# Altium schematic sheet main.SchDoc
size A4
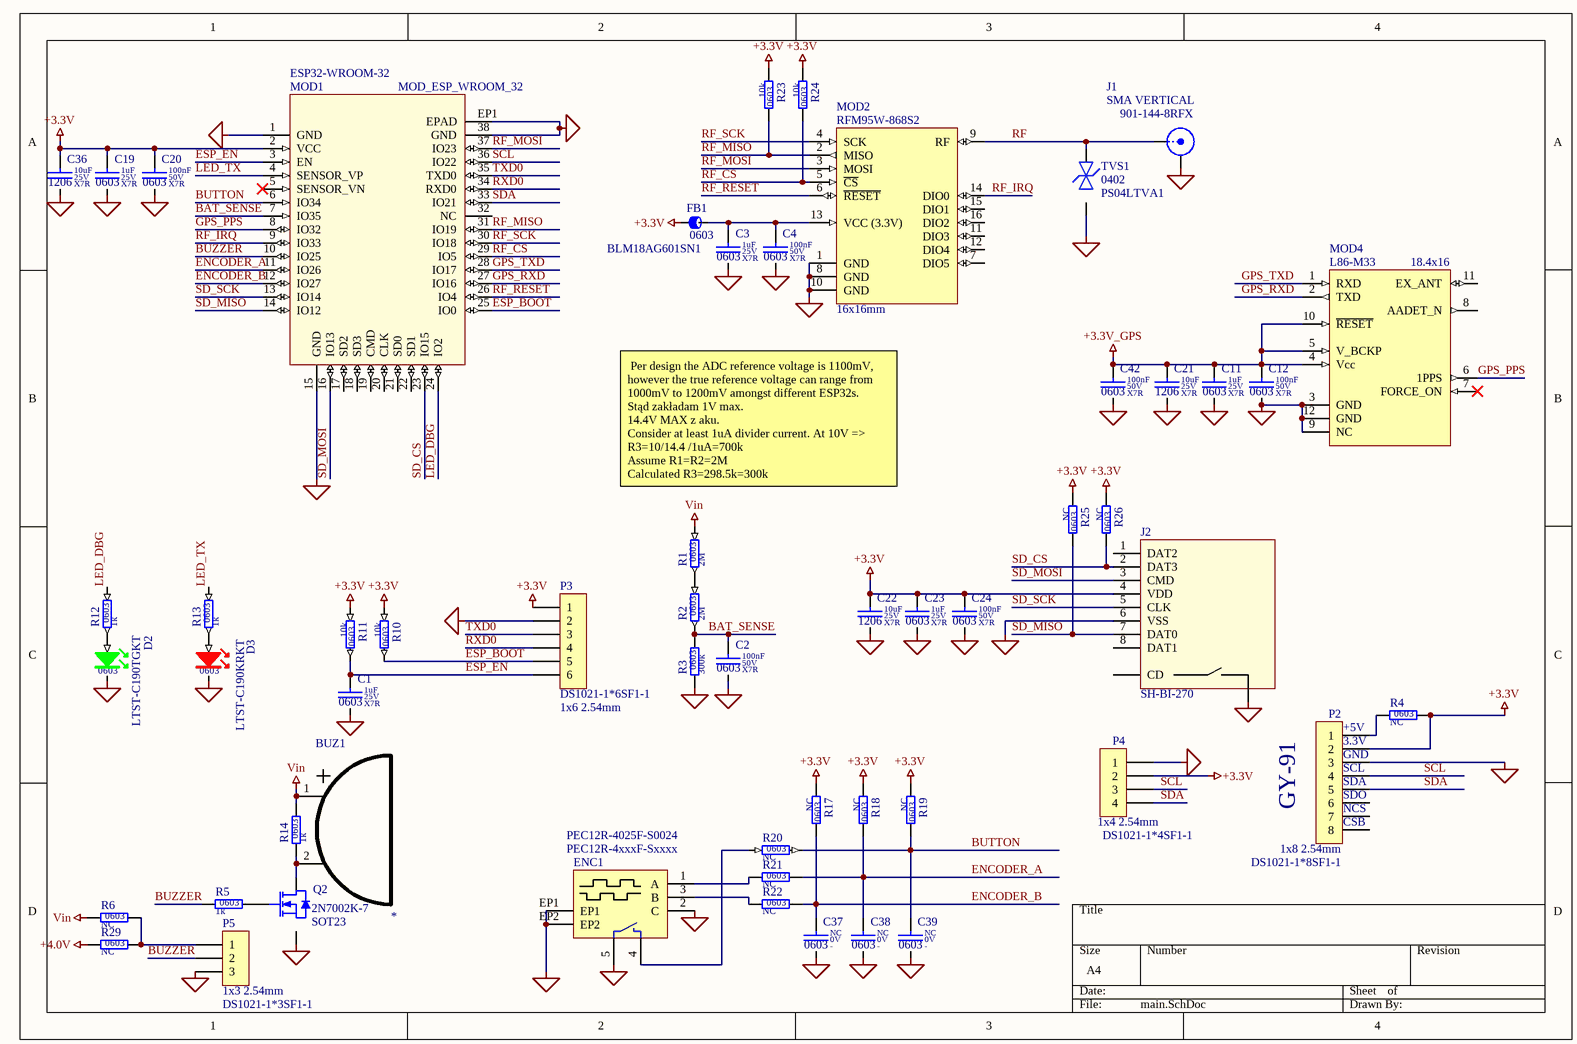
[diagram p0: main.SchDoc]

## Parts
BUZ1  BUZ_CHINA  [BUZ_CHINA]  (value not drawn)
C1  value 1uF  Dielectric: X7R  Voltage: 25V  SCH_Footprint: 0603  [C_0603_1608]  (hidden comment: Ceramic X7R)
C2  value 100nF  Dielectric: X7R  Voltage: 50V  SCH_Footprint: 0603  [C_0603_1608]  (hidden comment: Ceramic X7R)
C3  value 1uF  Dielectric: X7R  Voltage: 25V  SCH_Footprint: 0603  [C_0603_1608]  (hidden comment: Ceramic X7R)
C4  value 100nF  Dielectric: X7R  Voltage: 50V  SCH_Footprint: 0603  [C_0603_1608]  (hidden comment: Ceramic X7R)
C11  value 1uF  Dielectric: X7R  Voltage: 25V  SCH_Footprint: 0603  [C_0603_1608]  (hidden comment: Ceramic X7R)
C12  value 100nF  Dielectric: X7R  Voltage: 50V  SCH_Footprint: 0603  [C_0603_1608]  (hidden comment: Ceramic X7R)
C19  value 1uF  Dielectric: X7R  Voltage: 25V  SCH_Footprint: 0603  [C_0603_1608]  (hidden comment: Ceramic X7R)
C20  value 100nF  Dielectric: X7R  Voltage: 50V  SCH_Footprint: 0603  [C_0603_1608]  (hidden comment: Ceramic X7R)
C21  value 10uF  Dielectric: X7R  Voltage: 25V  SCH_Footprint: 1206  [C_1206_3216]  (hidden comment: Ceramic X7R)
C22  value 10uF  Dielectric: X7R  Voltage: 25V  SCH_Footprint: 1206  [C_1206_3216]  (hidden comment: Ceramic X7R)
C23  value 1uF  Dielectric: X7R  Voltage: 25V  SCH_Footprint: 0603  [C_0603_1608]  (hidden comment: Ceramic X7R)
C24  value 100nF  Dielectric: X7R  Voltage: 50V  SCH_Footprint: 0603  [C_0603_1608]  (hidden comment: Ceramic X7R)
C36  value 10uF  Dielectric: X7R  Voltage: 25V  SCH_Footprint: 1206  [C_1206_3216]  (hidden comment: Ceramic X7R)
C37  value NC  Voltage: 0V  SCH_Footprint: 0603  [C_NC_0603_1608]  (hidden comment: -)
C38  value NC  Voltage: 0V  SCH_Footprint: 0603  [C_NC_0603_1608]  (hidden comment: -)
C39  value NC  Voltage: 0V  SCH_Footprint: 0603  [C_NC_0603_1608]  (hidden comment: -)
C42  value 100nF  Dielectric: X7R  Voltage: 50V  SCH_Footprint: 0603  [C_0603_1608]  (hidden comment: Ceramic X7R)
D2  value LTST-C190TGKT  SCH_Footprint: 0603  [OL_0603_1608]  (hidden comment: Green Led)
D3  value LTST-C190KRKT  SCH_Footprint: 0603  [OL_0603_1608]  (hidden comment: Red Led)
ENC1  value PEC12R-4025F-S0024  [PEC12R-4xxxF-Sxxxx]  (hidden comment: ENCODER)
FB1  value BLM18AG601SN1  SCH_Footprint: 0603  [FB_0603_1608]  (hidden comment: Ferrite bead)
J1  value 901-144-8RFX  [J_SMA_VERTICAL]  (hidden comment: SMA VERTICAL)
J2  SH-BI-270  [SDCARD]
MOD1  value ESP32-WROOM-32  [MOD_ESP_WROOM_32]  (hidden comment: 2.4 GHz Wi-Fi-and-Bluetooth combo chip)
MOD2  value RFM95W-868S2  SCH_Footprint: 16x16mm  [MOD_RFM95]  (hidden comment: RFM95(W) - Low Power Long Range Transceiver Module + LoRa)
MOD4  value L86-M33  SCH_Footprint: 18.4x16  [MOD_L86-M33]  (hidden comment: GPS with Patch antenna)
P2  value DS1021-1*8SF1-1  SCH_Footprint: 1x8 2.54mm  [P_HEADER_1x8_2.54]  (hidden comment: Goldpin)
P3  value DS1021-1*6SF1-1  SCH_Footprint: 1x6 2.54mm  [P_HEADER_1x6_2.54]  (hidden comment: Goldpin)
P4  value DS1021-1*4SF1-1  SCH_Footprint: 1x4 2.54mm  [P_HEADER_1x4_2.54]  (hidden comment: Goldpin)
P5  value DS1021-1*3SF1-1  SCH_Footprint: 1x3 2.54mm  [P_HEADER_1x3_2.54]  (hidden comment: Goldpin)
Q2  SCH_Footprint: SOT23  [SOT23_TO236_SC59]  (hidden comment: 2N7002K-7)
R1  value 2M  SCH_Footprint: 0603  [R_0603_1608]  (hidden comment: Resistor)
R2  value 2M  SCH_Footprint: 0603  [R_0603_1608]  (hidden comment: Resistor)
R3  value 300k  SCH_Footprint: 0603  [R_0603_1608]  (hidden comment: Resistor)
R4  value NC  SCH_Footprint: 0603  [R_NC_0603_1608]  (hidden comment: Resistor)
R5  value 1k  SCH_Footprint: 0603  [R_0603_1608]  (hidden comment: Resistor)
R6  value NC  SCH_Footprint: 0603  [R_NC_0603_1608]  (hidden comment: Resistor)
R10  value 10k  SCH_Footprint: 0603  [R_0603_1608]  (hidden comment: Resistor)
R11  value 10k  SCH_Footprint: 0603  [R_0603_1608]  (hidden comment: Resistor)
R12  value 1k  SCH_Footprint: 0603  [R_0603_1608]  (hidden comment: Resistor)
R13  value 1k  SCH_Footprint: 0603  [R_0603_1608]  (hidden comment: Resistor)
R14  value 1k  SCH_Footprint: 0603  [R_0603_1608]  (hidden comment: Resistor)
R17  value NC  SCH_Footprint: 0603  [R_NC_0603_1608]  (hidden comment: Resistor)
R18  value NC  SCH_Footprint: 0603  [R_NC_0603_1608]  (hidden comment: Resistor)
R19  value NC  SCH_Footprint: 0603  [R_NC_0603_1608]  (hidden comment: Resistor)
R20  value NC  SCH_Footprint: 0603  [R_NC_0603_1608]  (hidden comment: Resistor)
R21  value NC  SCH_Footprint: 0603  [R_NC_0603_1608]  (hidden comment: Resistor)
R22  value NC  SCH_Footprint: 0603  [R_NC_0603_1608]  (hidden comment: Resistor)
R23  value 10k  SCH_Footprint: 0603  [R_0603_1608]  (hidden comment: Resistor)
R24  value 10k  SCH_Footprint: 0603  [R_0603_1608]  (hidden comment: Resistor)
R25  value NC  SCH_Footprint: 0603  [R_NC_0603_1608]  (hidden comment: Resistor)
R26  value NC  SCH_Footprint: 0603  [R_NC_0603_1608]  (hidden comment: Resistor)
R29  value NC  SCH_Footprint: 0603  [R_NC_0603_1608]  (hidden comment: Resistor)
TVS1  value PS04LTVA1  SCH_Footprint: 0402  [D_BI_0402_1005]  (hidden comment: ESD Suppressors / TVS Diodes)

## Nets
+3.3V: C19.1 C20.1 C22.1 C23.1 C24.1 C36.1 FB1.1 J2.4(VDD) MOD1.2(VCC) P2.2 P3.1 P4.2 R4.2 R10.1 R11.1 R17.1 R18.1 R19.1 R23.1 R24.1 R25.1 R26.1
+3.3V_GPS: C11.1 C12.1 C21.1 C42.1 MOD4.4(Vcc) MOD4.5(V_BCKP) MOD4.10(~{RESET})
+4.0V: R29.1
GND: C1.2 C2.2 C3.2 C4.2 C11.2 C12.2 C19.2 C20.2 C21.2 C22.2 C23.2 C24.2 C36.2 C37.2 C38.2 C39.2 C42.2 D2.1(K) D3.1(K) ENC1.2(C) ENC1.5(SW) ENC1.EP1 ENC1.EP2 J1.2(GND) J2.6(VSS) J2.S0(CD_VSS) MOD1.1(GND) MOD1.15(GND) MOD1.38(GND) MOD1.EP1(EPAD) MOD2.1(GND) MOD2.8(GND) MOD2.10(GND) MOD4.3(GND) MOD4.9(NC) MOD4.12(GND) P2.3 P3.2 P4.1 P5.3 Q2.2(S) R3.1 TVS1.2
Vin: BUZ1.1 R1.2 R6.1 R14.2
BAT_SENSE: C2.1 MOD1.7(IO35) R2.1 R3.2
BUTTON: C39.1 MOD1.6(IO34) R19.2 R20.2
BUZZER: MOD1.10(IO25) P5.2 R5.1
ENCODER_A: C38.1 MOD1.11(IO26) R18.2 R21.2
ENCODER_B: C37.1 MOD1.12(IO27) R17.2 R22.2
ESP_BOOT: MOD1.25(IO0) P3.5 R10.2
ESP_EN: C1.1 MOD1.3(EN) P3.6 R11.2
GPS_PPS: MOD1.8(IO32) MOD4.6(1PPS)
GPS_RXD: MOD1.27(IO16) MOD4.2(TXD)
GPS_TXD: MOD1.28(IO17) MOD4.1(RXD)
LED_DBG: MOD1.24(IO2) R12.2
LED_TX: MOD1.4(SENSOR_VP) R13.2
RF: J1.1(X) MOD2.9(RF) TVS1.1
RF_CS: MOD1.29(IO5) MOD2.5(~{CS}) R24.2
RF_IRQ: MOD1.9(IO33) MOD2.14(DIO0)
RF_MISO: MOD1.31(IO19) MOD2.2(MISO) R23.2
RF_MOSI: MOD1.37(IO23) MOD2.3(MOSI)
RF_RESET: MOD1.26(IO4) MOD2.6(~{RESET})
RF_SCK: MOD1.30(IO18) MOD2.4(SCK)
RXD0: MOD1.34(RXD0) P3.4
SCL: MOD1.36(IO22) P2.4 P4.3
SD_CS: J2.2(DAT3) MOD1.23(IO15) R26.2
SD_MISO: J2.7(DAT0) MOD1.14(IO12) R25.2
SD_MOSI: J2.3(CMD) MOD1.16(IO13)
SD_SCK: J2.5(CLK) MOD1.13(IO14)
SDA: MOD1.33(IO21) P2.5 P4.4
TXD0: MOD1.35(TXD0) P3.3
NetBUZ1_2: BUZ1.2 Q2.3(D) R14.1
NetC3_1: C3.1 C4.1 FB1.2 MOD2.13(VCC_(3.3V))
NetD2_2: D2.2(A) R12.1
NetD3_2: D3.2(A) R13.1
NetENC1_1: ENC1.1(A) R21.1
NetENC1_3: ENC1.3(B) R22.1
NetENC1_4: ENC1.4(SW) R20.1
NetP2_1: P2.1 R4.1
NetP5_1: P5.1 R6.2 R29.2
NetQ2_1: Q2.1(G) R5.2
NetR1_1: R1.1 R2.2

Not connected (* = marked no-connect by the designer): J2 1(DAT2) 8(DAT1) CD; MOD1 5(SENSOR_VN)* 17(SD2) 18(SD3) 19(CMD) 20(CLK) 21(SD0) 22(SD1) 32(NC); MOD2 7(DIO5) 11(DIO3) 12(DIO4) 15(DIO1) 16(DIO2); MOD4 7(FORCE_ON)* 8(AADET_N) 11(EX_ANT); P2 6 7 8

## Notes on the sheet
- Per design the ADC reference voltage is 1100mV, however the true reference voltage can range from 1000mV to 1200mV amongst different ESP32s.
  Stąd zakładam 1V max.
  14.4V MAX z aku.
  Consider at least 1uA divider current. At 10V =>
  R3=10/14.4 /1uA=700k
  Assume R1=R2=2M
  Calculated R3=298.5k=300k
- (near P2) +5V
- (near P2) 3.3V
- (near P2) GND
- (near P2) SCL
- (near P2) SDA
- (near P2) SDO
- (near P2) GY-91
- (near P2) NCS
- (near P2) CSB

## Library data of the parts
C1 C3 C11 C19 C23 = C_1uF_25V_X7R_0603_10: Capacitor; Manufacturer: Samsung; Manufacturer Part Number: CL10B105KA8NNNC; Tolerance (%): 10; Part Number: C_1uF_25V_X7R_0603_10; HelpURL: http://www.tme.eu/pl/Document/4a42202b32dab16128fe107dd69598cc/samsung-chip-cap.pdf; Supplier 1: TME; Supplier Part Number 1: CL10B105KA8NNNC; Supplier 2: RS Components; Supplier 3: Farnell; Supplier 4: Mouser; Supplier 5: Digi-Key; Supplier 6: LCSC
C2 C4 C12 C20 C24 C42 = C_100nF_50V_X7R_0603_5: Capacitor; Manufacturer: Samsung; Manufacturer Part Number: CL10B104JB8NNNC; Tolerance (%): 5; Part Number: C_100nF_50V_X7R_0603_5; HelpURL: http://www.tme.eu/pl/Document/4a42202b32dab16128fe107dd69598cc/samsung-chip-cap.pdf; Supplier 1: TME; Supplier Part Number 1: CL10B104JB8NNNC; Supplier 2: RS Components; Supplier Part Number 2: 7665455; Supplier 3: Farnell; Supplier 4: Mouser; Supplier 5: Digi-Key; Supplier Part Number 5: 1276-1033-1-ND; Supplier 6: LCSC; Supplier Part Number 6: C24452
C21 C22 C36 = C_10uF_25V_X7R_1206_10: Capacitor; Manufacturer: Samsung Electro-Mechanics; Manufacturer Part Number: CL31B106KAHNNNE; Tolerance (%): 10; Part Number: C_10uF_25V_X7R_1206_10; HelpURL: http://www.tme.eu/pl/Document/4a42202b32dab16128fe107dd69598cc/samsung-chip-cap.pdf; Supplier 1: TME; Supplier Part Number 1: CL31B106KAHNNNE; Supplier 2: RS Components; Supplier 3: Farnell; Supplier 4: Mouser; Supplier 5: Digi-Key; Supplier 6: LCSC
C37-C39 = C_GENERIC_0603: Capacitor; Tolerance (%): 0; Dielectric: -; Part Number: C_GENERIC_0603; HelpURL: http://-; Manufacturer: -; Manufacturer Part Number: -; Supplier 1: TME; Supplier 2: RS Components; Supplier 3: Farnell; Supplier 4: Mouser; Supplier 5: Digi-Key; Supplier 6: LCSC
D2 = OL_G_0603: LED GREEN; Manufacturer: Lite-On; Part Number: OL_G_0603; HelpURL: https://datasheet.octopart.com/LTST-C190TGKT-Lite-On-datasheet-158437.pdf; Manufacturer Part Number: LTST-C190TGKT; Supplier 1: TME; Supplier Part Number 1: LTST-C190TGKT; Supplier 2: RS Components; Supplier Part Number 2: 6920997P; Supplier 3: Farnell; Supplier 4: Mouser; Supplier Part Number 4: 859-LTST-C190TGKT; Supplier 5: Digi-Key; Supplier Part Number 5: 160-2019-1-ND; Supplier 6: LCSC
D3 = OL_R_0603: LED_RED; Manufacturer: Lite-On; Part Number: OL_R_0603; HelpURL: https://datasheet.octopart.com/LTST-C190KRKT-Lite-On-datasheet-158191.pdf; Manufacturer Part Number: LTST-C190KRKT; Supplier 1: TME; Supplier Part Number 1: LTST-C190KRKT; Supplier 2: RS Components; Supplier Part Number 2: 1769795; Supplier 3: Farnell; Supplier 4: Mouser; Supplier Part Number 4: 859-LTST-C190KRKT; Supplier 5: Digi-Key; Supplier Part Number 5: 160-1436-1-ND; Supplier 6: LCSC
ENC1 = ENC_PEC12R-4025F-S0024: Manufacturer: Bourns; Part Number: ENC_PEC12R-4025F-S0024; SCH_Footprint: PEC12R-4xxxF-Sxxxx; HelpURL: https://datasheet.octopart.com/PEC12R-4025F-S0024-Bourns-datasheet-44395047.pdf; Manufacturer Part Number: PEC12R-4025F-S0024; Supplier 1: TME; Supplier Part Number 1: PEC12R-4025F-S0024; Supplier 2: RS Components; Supplier Part Number 2: 789-9649; Supplier 3: Farnell; Supplier Part Number 3: 2814036; Supplier 4: Mouser; Supplier Part Number 4: 652-PEC12R-4025F-S24; Supplier 5: Digi-Key; Supplier Part Number 5: PEC12R-4025F-S0024-ND; Supplier 6: LCSC
FB1 = FB_BLM18AG601SN1: Manufacturer: Murata; Manufacturer Part Number: BLM18AG601SN1D; Current: 500mA; Resistance: 600R; Part Number: FB_BLM18AG601SN1; HelpURL: http://datasheet.octopart.com/BLM18AG601SN1D-Murata-datasheet-11743096.pdf; Supplier 1: TME; Supplier Part Number 1: BLM18AG601SN1D; Supplier 2: RS Components; Supplier Part Number 2: 7241299P; Supplier 3: Farnell; Supplier Part Number 3: 1515679; Supplier 4: Mouser; Supplier Part Number 4: 81-BLM11A601S; Supplier 5: Digi-Key; Supplier Part Number 5: 490-1014-1-ND; Supplier 6: LCSC
J1 = J_SMA_VERTICAL: SMA connector; Manufacturer: Amphenol RF; Part Number: J_SMA_VERTICAL; SCH_Footprint: SMA VERTICAL; HelpURL: http://www.mouser.com/ds/2/18/C901-144-8RFX-710432.pdf; Manufacturer Part Number: 901-144-8RFX; Supplier 1: TME; Supplier 2: RS Components; Supplier 3: Farnell; Supplier Part Number 3: 1339820; Supplier 4: Mouser; Supplier Part Number 4: 523-901-144-8RFX; Supplier 5: Digi-Key; Supplier Part Number 5: ARFX1231-ND; Supplier 6: LCSC
J2 = sd_china: SH-BI-270 Chinese microSD socket; CustomComponentID: xyn8wfk4aykgkvbxxkv0
MOD1 = MOD_ESP32-WROOM-32: Manufacturer: ESPRESSIF; SCH_Footprint: MOD_ESP_WROOM_32; Part Number: MOD_ESP32-WROOM-32; HelpURL: https://www.espressif.com/sites/default/files/documentation/esp32_datasheet_en.pdf; Manufacturer Part Number: ESP32-WROOM-32; Supplier 1: TME; Supplier Part Number 1: ESP32-WROOM-32; Supplier 2: RS Components; Supplier Part Number 2: 169-7594; Supplier 3: Farnell; Supplier 4: Mouser; Supplier Part Number 4: 356-ESP-WROOM-32; Supplier 5: Digi-Key; Supplier Part Number 5: 1904-1010-1-ND; Supplier 6: LCSC
MOD2 = MOD_RFM95W-868S2: RFM95/96/97/98(W) - Low Power Long Range Transceiver Module; Manufacturer: HopeRF; Part Number: MOD_RFM95W-868S2; HelpURL: https://cdn.sparkfun.com/assets/learn_tutorials/8/0/4/RFM95_96_97_98W.pdf; Manufacturer Part Number: RFM95W-868S2; Supplier 1: TME; Supplier Part Number 1: RFM95W-868S2; Supplier 2: RS Components; Supplier Part Number 2: 1251259; Supplier 3: Farnell; Supplier Part Number 3: 2759294; Supplier 4: Mouser; Supplier Part Number 4: 223-RFM95W-868S2; Supplier 5: Digi-Key; Supplier Part Number 5: RFM95W-868S2-ND; Supplier 6: LCSC
MOD4 = MOD_L86-M33: GPS; Manufacturer: Quectel; Part Number: MOD_L86-M33; HelpURL: https://www.codico.com/shop/media/datasheets/Quectel_L86_Hardware_Design_V1.1.pdf; Manufacturer Part Number: L86-M33; Supplier 1: TME; Supplier 2: RS Components; Supplier Part Number 2: 9084114; Supplier 3: Farnell; Supplier 4: Mouser; Supplier 5: Digi-Key; Supplier 6: LCSC
P2 = P_HEADER_1x8_2.54: Pin Header; Manufacturer: Connfly; Part Number: P_HEADER_1x8_2.54; HelpURL: http://www.tme.eu/en/Document/cc301e58a5da78cb543a94b5a5b7f06a/DS1021.pdf; Manufacturer Part Number: DS1021-1*8SF1-1; Supplier 1: TME; Supplier Part Number 1: ZL201-08G; Supplier 2: RS Components; Supplier 3: Farnell; Supplier 4: Mouser; Supplier 5: Digi-Key; Supplier 6: LCSC
P3 = P_HEADER_1x6_2.54: Pin Header; Manufacturer: Connfly; Part Number: P_HEADER_1x6_2.54; HelpURL: http://www.tme.eu/en/Document/cc301e58a5da78cb543a94b5a5b7f06a/DS1021.pdf; Manufacturer Part Number: DS1021-1*6SF1-1; Supplier 1: TME; Supplier Part Number 1: ZL201-06G; Supplier 2: RS Components; Supplier 3: Farnell; Supplier 4: Mouser; Supplier 5: Digi-Key; Supplier 6: LCSC
P4 = P_HEADER_1x4_2.54: Pin Header; Manufacturer: Connfly; Part Number: P_HEADER_1x4_2.54; HelpURL: http://datasheet.octopart.com/DS1021-1%2A4SF1-1-Connfly-datasheet-65537859.pdf; Manufacturer Part Number: DS1021-1*4SF1-1; Supplier 1: TME; Supplier Part Number 1: ZL201-04G; Supplier 2: RS Components; Supplier 3: Farnell; Supplier 4: Mouser; Supplier 5: Digi-Key; Supplier 6: LCSC
P5 = P_HEADER_1x3_2.54: Pin Header; Manufacturer: Connfly; Part Number: P_HEADER_1x3_2.54; HelpURL: http://www.tme.eu/en/Document/cc301e58a5da78cb543a94b5a5b7f06a/DS1021.pdf; Manufacturer Part Number: DS1021-1*3SF1-1; Supplier 1: TME; Supplier Part Number 1: ZL201-03G; Supplier 2: RS Components; Supplier 3: Farnell; Supplier 4: Mouser; Supplier 5: Digi-Key; Supplier 6: LCSC
Q2 = QN_2N7002K-7_60V_350mA: Manufacturer: DIODES inc; Type: N-MOS; Voltage: 60V; Current: 0A8; Part Number: QN_2N7002K-7_60V_350mA; Value: 2N7002K-7; HelpURL: http://datasheet.octopart.com/2N7002K-7-Diodes-Inc.-datasheet-12515815.pdf; Manufacturer Part Number: 2N7002K-7; Supplier 1: TME; Supplier 2: RS Components; Supplier Part Number 2: 7703383; Supplier 3: Farnell; Supplier Part Number 3: 1713825; Supplier 4: Mouser; Supplier Part Number 4: 621-2N7002K-7; Supplier 5: Digi-Key; Supplier Part Number 5: 2N7002K-7DICT-ND; Supplier 6: LCSC
R1 R2 = R_2M_0603_1: Manufacturer: Panasonic; Manufacturer Part Number: ERJ-3EKF2004V; Voltage: 75V; Power: 100mW; Tolerance: 1%; Part Number: R_2M_0603_1; HelpURL: https://datasheet.octopart.com/ERJ-3EKF2004V-Panasonic-datasheet-13266541.pdf; Supplier 1: TME; Supplier 2: RS Components; Supplier 3: Farnell; Supplier Part Number 3: 2797362; Supplier 4: Mouser; Supplier Part Number 4: 667-ERJ-3EKF2004V; Supplier 5: Digi-Key; Supplier Part Number 5: P2.00MHCT-ND; Supplier 6: LCSC
R3 = R_300k_0603_5: Manufacturer: Yageo; Manufacturer Part Number: RC0603JR-07300KL; Voltage: 75V; Power: 100mW; Tolerance: 5%; Part Number: R_300k_0603_5; HelpURL: https://pl.mouser.com/datasheet/2/447/PYu-RC_Group_51_RoHS_L_10-1664068.pdf; Supplier 1: TME; Supplier Part Number 1: RC0603JR-07300K; Supplier 2: RS Components; Supplier 3: Farnell; Supplier Part Number 3: 3495948; Supplier 4: Mouser; Supplier Part Number 4: 603-RC0603JR-07300KL; Supplier 5: Digi-Key; Supplier Part Number 5: 311-300KGRCT-ND; Supplier 6: LCSC
R4 R6 R17-R22 R25 R26 R29 = R_GENERIC_0603: Part Number: R_GENERIC_0603; Supplier 1: TME; Supplier 2: RS Components; Supplier 3: Farnell; Supplier 4: Mouser; Supplier 5: Digi-Key; Supplier 6: LCSC
R5 R12-R14 = R_1k_0603_1: Manufacturer: Vishay; Manufacturer Part Number: CRCW06031K00FKEA; Voltage: 75V; Power: 100mW; Tolerance: 1%; Part Number: R_1k_0603_1; HelpURL: http://www.farnell.com/datasheets/2310790.pdf?_ga=2.256888843.1690599162.1548417389-1379097396.1542296996&_gac=1.262631934.1547230258.Cj0KCQiAmuHhBRD0ARIsAFWyPwhX8HcvXnM3tA0ZBodZLzDIjH2ZxLpjT5LWo9bad_HPRbU8LfPq44UaAhEwEALw_wcB; Supplier 1: TME; Supplier 2: RS Components; Supplier Part Number 2: 678-9875P; Supplier 3: Farnell; Supplier Part Number 3: 1469740; Supplier 4: Mouser; Supplier Part Number 4: 71-CRCW0603-1.0K-E3; Supplier 5: Digi-Key; Supplier Part Number 5: 541-1.00KHCT-ND; Supplier 6: LCSC
R10 R11 R23 R24 = R_10k_0603_1: Manufacturer: Vishay; Manufacturer Part Number: CRCW060310K0FKTABC; Voltage: 75V; Power: 100mW; Tolerance: 1%; Part Number: R_10k_0603_1; HelpURL: http://www.tme.eu/pl/Document/622e28308c06d160637f2b14751ba16b/Data%20Sheet%20CRCW_BCe3.pdf; Supplier 1: TME; Supplier Part Number 1: CRCW060310K0FKTABC; Supplier 2: RS Components; Supplier 3: Farnell; Supplier 4: Mouser; Supplier Part Number 4: 667-ERJ-3EKF1002V; Supplier 5: Digi-Key; Supplier Part Number 5: P10KGCT-ND; Supplier 6: LCSC
TVS1 = TVS_PS04LTVA1: Manufacturer: Bussmann; Voltage: 12V; Part Number: TVS_PS04LTVA1; HelpURL: https://pl.mouser.com/datasheet/2/87/31fc02c3-c2a7-4757-9ba5-5a4597d899a4-33212.pdf; Manufacturer Part Number: PS04LTVA1; Supplier 1: TME; Supplier 2: RS Components; Supplier 3: Farnell; Supplier 4: Mouser; Supplier Part Number 4: 504-PS04LTVA1; Supplier 5: Digi-Key; Supplier 6: LCSC
BUZ1 = BUZ_CHINA: SCH_Footprint: *